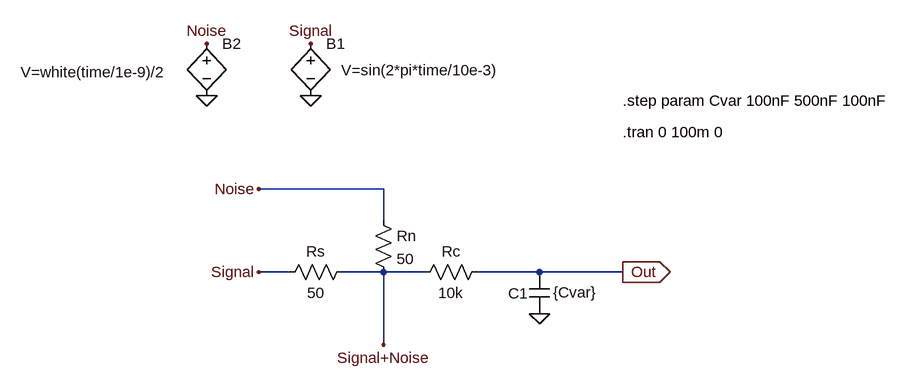
[diagram p0: schematic Fuente_Con_Ruido_Blanco.asc]
Fuente_Con_Ruido_Blanco.asc, the LTspice schematic file:
Version 4
SHEET 1 972 700
WIRE 144 256 -48 256
WIRE 144 304 144 256
WIRE 0 384 -48 384
WIRE 144 384 80 384
WIRE 208 384 144 384
WIRE 384 384 288 384
WIRE 512 384 384 384
WIRE 144 496 144 384
FLAG 32 112 0
FLAG 32 32 Signal
FLAG 384 448 0
FLAG -48 384 Signal
FLAG 512 384 Out
IOPIN 512 384 Out
FLAG -128 32 Noise
FLAG -48 256 Noise
FLAG -128 112 0
FLAG 144 496 Signal+Noise
SYMBOL bv 32 16 R0
WINDOW 3 47 57 Left 2
SYMATTR InstName B1
SYMATTR Value V=sin(2*pi*time/10e-3)
SYMBOL cap 368 384 R0
WINDOW 0 -32 33 Left 2
WINDOW 3 37 31 Left 2
SYMATTR InstName C1
SYMATTR Value {Cvar}
SYMBOL res -16 400 R270
WINDOW 0 32 56 VTop 2
WINDOW 3 0 56 VBottom 2
SYMATTR InstName Rs
SYMATTR Value 50
SYMATTR SpiceLine tol=1 pwr=0.1
SYMBOL res 192 400 R270
WINDOW 0 32 56 VTop 2
WINDOW 3 0 56 VBottom 2
SYMATTR InstName Rc
SYMATTR Value 10k
SYMBOL res 128 288 R0
SYMATTR InstName Rn
SYMATTR Value 50
SYMBOL bv -128 16 R0
WINDOW 3 -286 60 Left 2
SYMATTR InstName B2
SYMATTR Value V=white(time/1e-9)/2
TEXT 512 168 Left 2 !.tran 0 100m 0
TEXT 512 120 Left 2 !.step param Cvar 100nF 500nF 100nF

The netlist it stands for:
* Fuente_Con_Ruido_Blanco.asc
B1 Signal 0 V=sin(2*pi*time/10e-3)
C1 Out 0 {Cvar}
Rs Signal Signal+Noise 50 tol=1 pwr=0.1
Rc Signal+Noise Out 10k
Rn Noise Signal+Noise 50
B2 Noise 0 V=white(time/1e-9)/2
.tran 0 100m 0
.step param Cvar 100nF 500nF 100nF
.backanno
.end